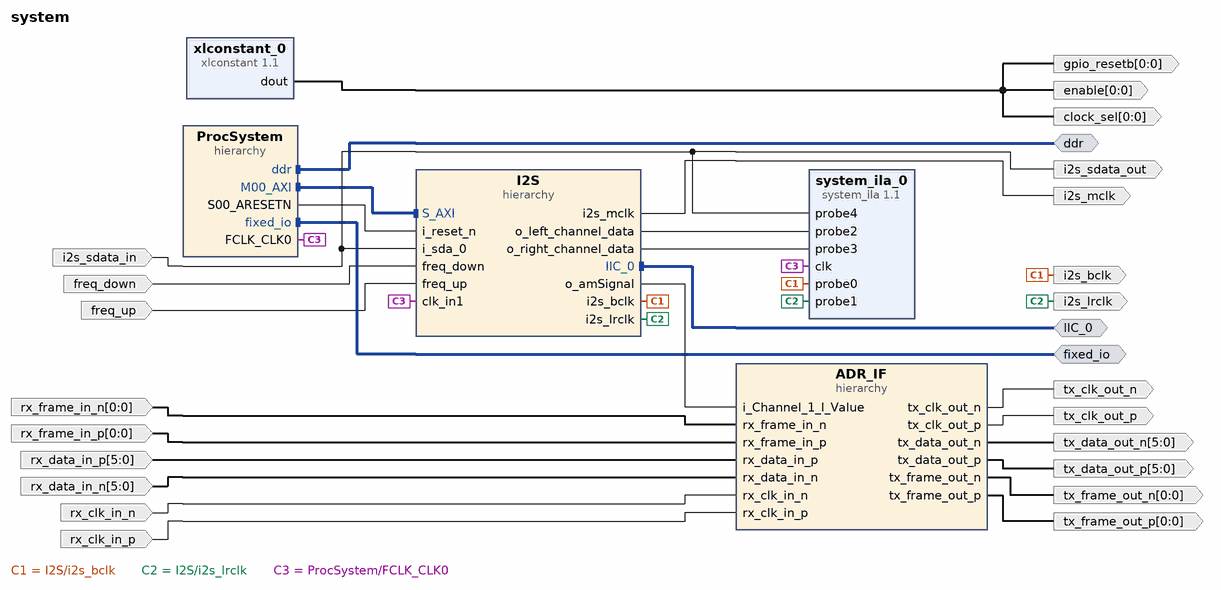
[diagram p0: block diagram of the top level]
# Vivado block design system, xc7z035ifbg676-2L, Vivado 2021.1
create_bd_design system

create_bd_intf_port -mode Master -vlnv xilinx.com:interface:ddrx_rtl:1.0 ddr
create_bd_intf_port -mode Master -vlnv xilinx.com:display_processing_system7:fixedio_rtl:1.0 fixed_io
create_bd_intf_port -mode Master -vlnv xilinx.com:interface:iic_rtl:1.0 IIC_0
create_bd_port -dir O -type clk i2s_bclk
create_bd_port -dir O i2s_lrclk
create_bd_port -dir I freq_up
create_bd_port -dir I freq_down
create_bd_port -dir O -type clk i2s_mclk
set_property -dict {CONFIG.FREQ_HZ 12293853} [get_bd_ports i2s_mclk]
create_bd_port -dir I -type clk rx_clk_in_n
create_bd_port -dir I -type clk rx_clk_in_p
create_bd_port -dir O -type clk tx_clk_out_n
create_bd_port -dir O -type clk tx_clk_out_p
create_bd_port -dir O -from 5 -to 0 tx_data_out_p
create_bd_port -dir O -from 0 -to 0 tx_frame_out_p
create_bd_port -dir O -from 5 -to 0 tx_data_out_n
create_bd_port -dir O -from 0 -to 0 tx_frame_out_n
create_bd_port -dir I -from 0 -to 0 rx_frame_in_n
create_bd_port -dir I -from 0 -to 0 rx_frame_in_p
create_bd_port -dir I -from 5 -to 0 rx_data_in_p
create_bd_port -dir I -from 5 -to 0 rx_data_in_n
create_bd_port -dir O -from 0 -to 0 clock_sel
create_bd_port -dir O -from 0 -to 0 enable
create_bd_port -dir O -from 0 -to 0 gpio_resetb
create_bd_port -dir O i2s_sdata_out
create_bd_port -dir I i2s_sdata_in

create_bd_cell -type hier ProcSystem
create_bd_cell -type hier I2S
create_bd_cell -type hier ADR_IF
create_bd_cell -type ip -vlnv xilinx.com:ip:xlconstant:1.1 xlconstant_0
create_bd_cell -type ip -vlnv xilinx.com:ip:system_ila:1.1 system_ila_0
set_property -dict [list \
  CONFIG.C_DATA_DEPTH 65536 \
  CONFIG.C_MON_TYPE NATIVE \
  CONFIG.C_NUM_OF_PROBES 5 \
  CONFIG.C_PROBE0_TYPE 0 \
] [get_bd_cells system_ila_0]

# ---- hierarchy /ProcSystem ----
current_bd_instance /ProcSystem
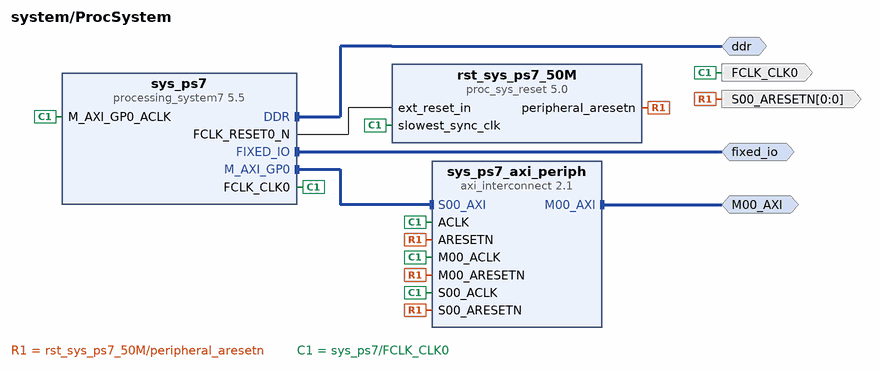
[diagram p1: block diagram inside /ProcSystem]
create_bd_intf_pin -mode Master -vlnv xilinx.com:interface:ddrx_rtl:1.0 ddr
create_bd_intf_pin -mode Master -vlnv xilinx.com:display_processing_system7:fixedio_rtl:1.0 fixed_io
create_bd_intf_pin -mode Master -vlnv xilinx.com:interface:aximm_rtl:1.0 M00_AXI
create_bd_pin -dir O -type clk FCLK_CLK0
create_bd_pin -dir O -from 0 -to 0 -type rst S00_ARESETN

create_bd_cell -type ip -vlnv xilinx.com:ip:processing_system7:5.5 sys_ps7
set_property -dict [list \
  CONFIG.PCW_APU_PERIPHERAL_FREQMHZ 666.666666 \
  CONFIG.PCW_CPU_CPU_6X4X_MAX_RANGE 800 \
  CONFIG.PCW_ENET0_PERIPHERAL_ENABLE 0 \
  CONFIG.PCW_ENET1_PERIPHERAL_CLKSRC External \
  CONFIG.PCW_FPGA0_PERIPHERAL_FREQMHZ 100 \
  CONFIG.PCW_FPGA1_PERIPHERAL_FREQMHZ 200.0 \
  CONFIG.PCW_FPGA2_PERIPHERAL_FREQMHZ 200.0 \
  CONFIG.PCW_GPIO_MIO_GPIO_ENABLE 0 \
  CONFIG.PCW_IRQ_F2P_INTR 1 \
  CONFIG.PCW_IRQ_F2P_MODE REVERSE \
  CONFIG.PCW_PERIPHERAL_BOARD_PRESET None \
  CONFIG.PCW_PRESET_BANK0_VOLTAGE {LVCMOS 1.8V} \
  CONFIG.PCW_PRESET_BANK1_VOLTAGE {LVCMOS 1.8V} \
  CONFIG.PCW_QSPI_PERIPHERAL_ENABLE 0 \
  CONFIG.PCW_SD0_PERIPHERAL_ENABLE 0 \
  CONFIG.PCW_UART1_PERIPHERAL_ENABLE 1 \
  CONFIG.PCW_UART1_UART1_IO {MIO 48 .. 49} \
  CONFIG.PCW_UART_PERIPHERAL_FREQMHZ 100 \
  CONFIG.PCW_UIPARAM_DDR_FREQ_MHZ 533.333333 \
  CONFIG.PCW_UIPARAM_DDR_PARTNO {MT41K256M16 RE-125} \
  CONFIG.PCW_USB0_PERIPHERAL_ENABLE 0 \
  CONFIG.PCW_USE_FABRIC_INTERRUPT 1 \
  CONFIG.preset None \
] [get_bd_cells sys_ps7]
# 339 more settings of sys_ps7 are not shown: defaults, MIO pin electricals, DDR timing, and values the tool derives
create_bd_cell -type ip -vlnv xilinx.com:ip:proc_sys_reset:5.0 rst_sys_ps7_50M
create_bd_cell -type ip -vlnv xilinx.com:ip:axi_interconnect:2.1 sys_ps7_axi_periph
set_property -dict {CONFIG.NUM_MI 1} [get_bd_cells sys_ps7_axi_periph]

# ---- hierarchy /I2S ----
current_bd_instance /I2S
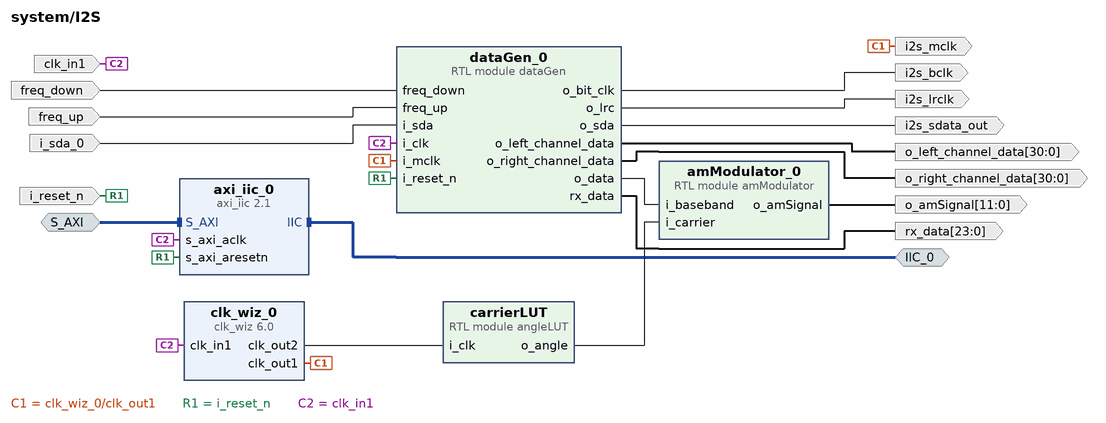
[diagram p2: block diagram inside /I2S]
create_bd_intf_pin -mode Slave -vlnv xilinx.com:interface:aximm_rtl:1.0 S_AXI
create_bd_intf_pin -mode Master -vlnv xilinx.com:interface:iic_rtl:1.0 IIC_0
create_bd_pin -dir I -type clk clk_in1
create_bd_pin -dir I i_reset_n
create_bd_pin -dir O i2s_mclk
create_bd_pin -dir O -type clk i2s_bclk
create_bd_pin -dir O i2s_lrclk
create_bd_pin -dir O i2s_sdata_out
create_bd_pin -dir I freq_up
create_bd_pin -dir I freq_down
create_bd_pin -dir O -from 11 -to 0 o_amSignal
create_bd_pin -dir I i_sda_0
create_bd_pin -dir O -from 23 -to 0 rx_data
create_bd_pin -dir O -from 30 -to 0 o_left_channel_data
create_bd_pin -dir O -from 30 -to 0 o_right_channel_data

create_bd_cell -type module -reference angleLUT carrierLUT
create_bd_cell -type ip -vlnv xilinx.com:ip:axi_iic:2.1 axi_iic_0
create_bd_cell -type ip -vlnv xilinx.com:ip:clk_wiz:6.0 clk_wiz_0
set_property -dict [list \
  CONFIG.CLKOUT1_JITTER 198.012 \
  CONFIG.CLKOUT1_PHASE_ERROR 96.739 \
  CONFIG.CLKOUT1_REQUESTED_OUT_FREQ 12.288 \
  CONFIG.CLKOUT2_JITTER 122.415 \
  CONFIG.CLKOUT2_PHASE_ERROR 96.739 \
  CONFIG.CLKOUT2_REQUESTED_OUT_FREQ 128 \
  CONFIG.CLKOUT2_USED true \
  CONFIG.MMCM_CLKFBOUT_MULT_F 10.250 \
  CONFIG.MMCM_CLKOUT0_DIVIDE_F 83.375 \
  CONFIG.MMCM_CLKOUT1_DIVIDE 8 \
  CONFIG.MMCM_DIVCLK_DIVIDE 1 \
  CONFIG.NUM_OUT_CLKS 2 \
  CONFIG.USE_LOCKED false \
  CONFIG.USE_RESET false \
] [get_bd_cells clk_wiz_0]
create_bd_cell -type module -reference amModulator amModulator_0
create_bd_cell -type module -reference dataGen dataGen_0

# ---- hierarchy /ADR_IF ----
current_bd_instance /ADR_IF
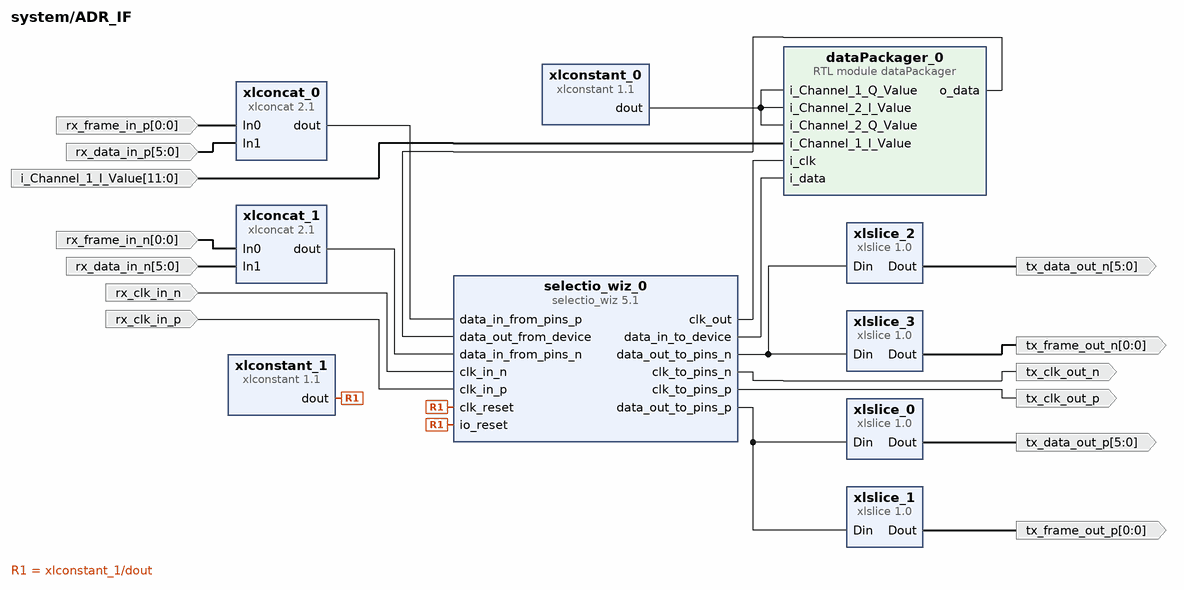
[diagram p3: block diagram inside /ADR_IF]
create_bd_pin -dir O -from 5 -to 0 tx_data_out_p
create_bd_pin -dir I -from 0 -to 0 rx_frame_in_p
create_bd_pin -dir I -from 5 -to 0 rx_data_in_p
create_bd_pin -dir I -from 0 -to 0 rx_frame_in_n
create_bd_pin -dir I -from 5 -to 0 rx_data_in_n
create_bd_pin -dir O -from 0 -to 0 tx_frame_out_p
create_bd_pin -dir O -from 5 -to 0 tx_data_out_n
create_bd_pin -dir I -from 11 -to 0 i_Channel_1_I_Value
create_bd_pin -dir I -type clk rx_clk_in_p
create_bd_pin -dir I -type clk rx_clk_in_n
create_bd_pin -dir O -type clk tx_clk_out_p
create_bd_pin -dir O -type clk tx_clk_out_n
create_bd_pin -dir O -from 0 -to 0 tx_frame_out_n

create_bd_cell -type ip -vlnv xilinx.com:ip:xlslice:1.0 xlslice_0
set_property -dict {CONFIG.DIN_FROM 6 CONFIG.DIN_TO 1 CONFIG.DIN_WIDTH 7 CONFIG.DOUT_WIDTH 6} [get_bd_cells xlslice_0]
create_bd_cell -type ip -vlnv xilinx.com:ip:xlconcat:2.1 xlconcat_0
set_property -dict {CONFIG.IN0_WIDTH 1 CONFIG.IN1_WIDTH 6} [get_bd_cells xlconcat_0]
create_bd_cell -type ip -vlnv xilinx.com:ip:xlconcat:2.1 xlconcat_1
set_property -dict {CONFIG.IN0_WIDTH 1 CONFIG.IN1_WIDTH 6} [get_bd_cells xlconcat_1]
create_bd_cell -type ip -vlnv xilinx.com:ip:xlconstant:1.1 xlconstant_0
set_property -dict {CONFIG.CONST_VAL 0 CONFIG.CONST_WIDTH 12} [get_bd_cells xlconstant_0]
create_bd_cell -type ip -vlnv xilinx.com:ip:xlslice:1.0 xlslice_1
set_property -dict {CONFIG.DIN_FROM 0 CONFIG.DIN_TO 0 CONFIG.DIN_WIDTH 7 CONFIG.DOUT_WIDTH 1} [get_bd_cells xlslice_1]
create_bd_cell -type ip -vlnv xilinx.com:ip:xlslice:1.0 xlslice_2
set_property -dict {CONFIG.DIN_FROM 6 CONFIG.DIN_TO 1 CONFIG.DIN_WIDTH 7 CONFIG.DOUT_WIDTH 6} [get_bd_cells xlslice_2]
create_bd_cell -type ip -vlnv xilinx.com:ip:xlconstant:1.1 xlconstant_1
set_property -dict {CONFIG.CONST_VAL 0} [get_bd_cells xlconstant_1]
create_bd_cell -type module -reference dataPackager dataPackager_0
create_bd_cell -type ip -vlnv xilinx.com:ip:selectio_wiz:5.1 selectio_wiz_0
set_property -dict [list \
  CONFIG.BUS_DIR SEPARATE \
  CONFIG.BUS_IO_STD LVDS \
  CONFIG.BUS_SIG_TYPE DIFF \
  CONFIG.CLK_FWD true \
  CONFIG.CLK_FWD_IO_STD LVDS \
  CONFIG.CLK_FWD_SIG_TYPE DIFF \
  CONFIG.SELIO_ACTIVE_EDGE DDR \
  CONFIG.SELIO_BUS_IN_DELAY NONE \
  CONFIG.SELIO_CLK_IO_STD LVDS \
  CONFIG.SELIO_CLK_SIG_TYPE DIFF \
  CONFIG.SELIO_INTERFACE_TYPE NETWORKING \
  CONFIG.SERIALIZATION_FACTOR 4 \
  CONFIG.SYSTEM_DATA_WIDTH 7 \
] [get_bd_cells selectio_wiz_0]
create_bd_cell -type ip -vlnv xilinx.com:ip:xlslice:1.0 xlslice_3
set_property -dict {CONFIG.DIN_FROM 0 CONFIG.DIN_TO 0 CONFIG.DIN_WIDTH 7 CONFIG.DOUT_WIDTH 1} [get_bd_cells xlslice_3]

# ---- connections ----

current_bd_instance /ProcSystem
connect_bd_intf_net [get_bd_intf_pins ddr] [get_bd_intf_pins sys_ps7/DDR]
connect_bd_intf_net [get_bd_intf_pins fixed_io] [get_bd_intf_pins sys_ps7/FIXED_IO]
connect_bd_intf_net [get_bd_intf_pins sys_ps7/M_AXI_GP0] [get_bd_intf_pins sys_ps7_axi_periph/S00_AXI]
connect_bd_intf_net [get_bd_intf_pins M00_AXI] [get_bd_intf_pins sys_ps7_axi_periph/M00_AXI]
connect_bd_net [get_bd_pins rst_sys_ps7_50M/peripheral_aresetn] \
  [get_bd_pins S00_ARESETN] [get_bd_pins sys_ps7_axi_periph/S00_ARESETN] [get_bd_pins sys_ps7_axi_periph/M00_ARESETN] \
  [get_bd_pins sys_ps7_axi_periph/ARESETN]
connect_bd_net -net sys_cpu_clk [get_bd_pins sys_ps7/FCLK_CLK0] \
  [get_bd_pins FCLK_CLK0] [get_bd_pins rst_sys_ps7_50M/slowest_sync_clk] [get_bd_pins sys_ps7_axi_periph/S00_ACLK] \
  [get_bd_pins sys_ps7_axi_periph/M00_ACLK] [get_bd_pins sys_ps7_axi_periph/ACLK] [get_bd_pins sys_ps7/M_AXI_GP0_ACLK]
connect_bd_net [get_bd_pins sys_ps7/FCLK_RESET0_N] [get_bd_pins rst_sys_ps7_50M/ext_reset_in]

current_bd_instance /I2S
connect_bd_intf_net [get_bd_intf_pins IIC_0] [get_bd_intf_pins axi_iic_0/IIC]
connect_bd_intf_net [get_bd_intf_pins S_AXI] [get_bd_intf_pins axi_iic_0/S_AXI]
connect_bd_net [get_bd_pins amModulator_0/o_amSignal] [get_bd_pins o_amSignal]
connect_bd_net [get_bd_pins carrierLUT/o_angle] [get_bd_pins amModulator_0/i_carrier]
connect_bd_net [get_bd_pins clk_wiz_0/clk_out1] [get_bd_pins i2s_mclk] [get_bd_pins dataGen_0/i_mclk]
connect_bd_net [get_bd_pins clk_wiz_0/clk_out2] [get_bd_pins carrierLUT/i_clk]
connect_bd_net -net dataGen_0_o_bit_clk [get_bd_pins dataGen_0/o_bit_clk] [get_bd_pins i2s_bclk]
connect_bd_net [get_bd_pins dataGen_0/o_data] [get_bd_pins amModulator_0/i_baseband]
connect_bd_net [get_bd_pins dataGen_0/o_left_channel_data] [get_bd_pins o_left_channel_data]
connect_bd_net [get_bd_pins dataGen_0/o_lrc] [get_bd_pins i2s_lrclk]
connect_bd_net [get_bd_pins dataGen_0/o_right_channel_data] [get_bd_pins o_right_channel_data]
connect_bd_net [get_bd_pins dataGen_0/o_sda] [get_bd_pins i2s_sdata_out]
connect_bd_net [get_bd_pins dataGen_0/rx_data] [get_bd_pins rx_data]
connect_bd_net -net freq_down_0_1 [get_bd_pins freq_down] [get_bd_pins dataGen_0/freq_down]
connect_bd_net -net freq_up_0_1 [get_bd_pins freq_up] [get_bd_pins dataGen_0/freq_up]
connect_bd_net -net i_sda_0_1 [get_bd_pins i_sda_0] [get_bd_pins dataGen_0/i_sda]
connect_bd_net -net rst_sys_ps7_50M_peripheral_aresetn [get_bd_pins i_reset_n] [get_bd_pins axi_iic_0/s_axi_aresetn] [get_bd_pins dataGen_0/i_reset_n]
connect_bd_net -net sys_cpu_clk [get_bd_pins clk_in1] [get_bd_pins clk_wiz_0/clk_in1] [get_bd_pins axi_iic_0/s_axi_aclk] [get_bd_pins dataGen_0/i_clk]
set_property HDL_ATTRIBUTE.DEBUG true [get_bd_nets dataGen_0_o_bit_clk]

current_bd_instance /ADR_IF
connect_bd_net -net In0_0_1 [get_bd_pins rx_frame_in_n] [get_bd_pins xlconcat_1/In0]
connect_bd_net -net In0_1_1 [get_bd_pins rx_frame_in_p] [get_bd_pins xlconcat_0/In0]
connect_bd_net -net In1_0_1 [get_bd_pins rx_data_in_p] [get_bd_pins xlconcat_0/In1]
connect_bd_net -net In1_1_1 [get_bd_pins rx_data_in_n] [get_bd_pins xlconcat_1/In1]
connect_bd_net -net amModulator_0_o_amSignal [get_bd_pins i_Channel_1_I_Value] [get_bd_pins dataPackager_0/i_Channel_1_I_Value]
connect_bd_net -net clk_in_n_0_1 [get_bd_pins rx_clk_in_n] [get_bd_pins selectio_wiz_0/clk_in_n]
connect_bd_net -net clk_in_p_0_1 [get_bd_pins rx_clk_in_p] [get_bd_pins selectio_wiz_0/clk_in_p]
connect_bd_net [get_bd_pins dataPackager_0/o_data] [get_bd_pins selectio_wiz_0/data_out_from_device]
connect_bd_net [get_bd_pins selectio_wiz_0/clk_out] [get_bd_pins dataPackager_0/i_clk]
connect_bd_net [get_bd_pins selectio_wiz_0/clk_to_pins_n] [get_bd_pins tx_clk_out_n]
connect_bd_net [get_bd_pins selectio_wiz_0/clk_to_pins_p] [get_bd_pins tx_clk_out_p]
connect_bd_net [get_bd_pins selectio_wiz_0/data_in_to_device] [get_bd_pins dataPackager_0/i_data]
connect_bd_net [get_bd_pins selectio_wiz_0/data_out_to_pins_n] [get_bd_pins xlslice_2/Din] [get_bd_pins xlslice_3/Din]
connect_bd_net [get_bd_pins selectio_wiz_0/data_out_to_pins_p] [get_bd_pins xlslice_0/Din] [get_bd_pins xlslice_1/Din]
connect_bd_net [get_bd_pins xlconcat_0/dout] [get_bd_pins selectio_wiz_0/data_in_from_pins_p]
connect_bd_net [get_bd_pins xlconcat_1/dout] [get_bd_pins selectio_wiz_0/data_in_from_pins_n]
connect_bd_net [get_bd_pins xlconstant_0/dout] \
  [get_bd_pins dataPackager_0/i_Channel_1_Q_Value] [get_bd_pins dataPackager_0/i_Channel_2_I_Value] \
  [get_bd_pins dataPackager_0/i_Channel_2_Q_Value]
connect_bd_net [get_bd_pins xlconstant_1/dout] [get_bd_pins selectio_wiz_0/clk_reset] [get_bd_pins selectio_wiz_0/io_reset]
connect_bd_net [get_bd_pins xlslice_0/Dout] [get_bd_pins tx_data_out_p]
connect_bd_net [get_bd_pins xlslice_1/Dout] [get_bd_pins tx_frame_out_p]
connect_bd_net [get_bd_pins xlslice_2/Dout] [get_bd_pins tx_data_out_n]
connect_bd_net [get_bd_pins xlslice_3/Dout] [get_bd_pins tx_frame_out_n]

current_bd_instance /
connect_bd_intf_net -intf_net axi_iic_0_IIC [get_bd_intf_ports IIC_0] [get_bd_intf_pins I2S/IIC_0]
connect_bd_intf_net -intf_net sys_ps7_DDR [get_bd_intf_ports ddr] [get_bd_intf_pins ProcSystem/ddr]
connect_bd_intf_net -intf_net sys_ps7_FIXED_IO [get_bd_intf_ports fixed_io] [get_bd_intf_pins ProcSystem/fixed_io]
connect_bd_intf_net [get_bd_intf_pins ProcSystem/M00_AXI] [get_bd_intf_pins I2S/S_AXI]
connect_bd_net [get_bd_pins I2S/o_left_channel_data] [get_bd_pins system_ila_0/probe2]
connect_bd_net [get_bd_pins I2S/o_right_channel_data] [get_bd_pins system_ila_0/probe3]
connect_bd_net -net In0_0_1 [get_bd_ports rx_frame_in_n] [get_bd_pins ADR_IF/rx_frame_in_n]
connect_bd_net -net In0_1_1 [get_bd_ports rx_frame_in_p] [get_bd_pins ADR_IF/rx_frame_in_p]
connect_bd_net -net In1_0_1 [get_bd_ports rx_data_in_p] [get_bd_pins ADR_IF/rx_data_in_p]
connect_bd_net -net In1_1_1 [get_bd_ports rx_data_in_n] [get_bd_pins ADR_IF/rx_data_in_n]
connect_bd_net -net amModulator_0_o_amSignal [get_bd_pins I2S/o_amSignal] [get_bd_pins ADR_IF/i_Channel_1_I_Value]
connect_bd_net -net clk_in_n_0_1 [get_bd_ports rx_clk_in_n] [get_bd_pins ADR_IF/rx_clk_in_n]
connect_bd_net -net clk_in_p_0_1 [get_bd_ports rx_clk_in_p] [get_bd_pins ADR_IF/rx_clk_in_p]
connect_bd_net -net clk_wiz_0_clk_out1 [get_bd_pins I2S/i2s_mclk] [get_bd_ports i2s_mclk]
connect_bd_net -net dataGen_0_o_bit_clk [get_bd_pins I2S/i2s_bclk] [get_bd_ports i2s_bclk] [get_bd_pins system_ila_0/probe0]
connect_bd_net -net dataGen_0_o_lrc [get_bd_pins I2S/i2s_lrclk] [get_bd_ports i2s_lrclk] [get_bd_pins system_ila_0/probe1]
connect_bd_net -net freq_down_0_1 [get_bd_ports freq_down] [get_bd_pins I2S/freq_down]
connect_bd_net -net freq_up_0_1 [get_bd_ports freq_up] [get_bd_pins I2S/freq_up]
connect_bd_net -net i_sda_0_0_1 [get_bd_ports i2s_sdata_in] [get_bd_pins I2S/i_sda_0] [get_bd_ports i2s_sdata_out] [get_bd_pins system_ila_0/probe4]
connect_bd_net -net rst_sys_ps7_50M_peripheral_aresetn [get_bd_pins ProcSystem/S00_ARESETN] [get_bd_pins I2S/i_reset_n]
connect_bd_net -net selectio_wiz_0_clk_to_pins_n [get_bd_pins ADR_IF/tx_clk_out_n] [get_bd_ports tx_clk_out_n]
connect_bd_net -net selectio_wiz_0_clk_to_pins_p [get_bd_pins ADR_IF/tx_clk_out_p] [get_bd_ports tx_clk_out_p]
connect_bd_net -net sys_cpu_clk [get_bd_pins ProcSystem/FCLK_CLK0] [get_bd_pins I2S/clk_in1] [get_bd_pins system_ila_0/clk]
connect_bd_net [get_bd_pins xlconstant_0/dout] [get_bd_ports clock_sel] [get_bd_ports enable] [get_bd_ports gpio_resetb]
connect_bd_net -net xlslice_0_Dout [get_bd_pins ADR_IF/tx_data_out_p] [get_bd_ports tx_data_out_p]
connect_bd_net -net xlslice_1_Dout [get_bd_pins ADR_IF/tx_frame_out_p] [get_bd_ports tx_frame_out_p]
connect_bd_net -net xlslice_2_Dout [get_bd_pins ADR_IF/tx_data_out_n] [get_bd_ports tx_data_out_n]
connect_bd_net -net xlslice_3_Dout [get_bd_pins ADR_IF/tx_frame_out_n] [get_bd_ports tx_frame_out_n]
set_property HDL_ATTRIBUTE.DEBUG true [get_bd_nets dataGen_0_o_bit_clk]
set_property HDL_ATTRIBUTE.MARK_DEBUG true [get_bd_nets dataGen_0_o_bit_clk]

# ---- address map ----
assign_bd_address -offset 0x41600000 -range 64K -target_address_space [get_bd_addr_spaces ProcSystem/sys_ps7/Data] [get_bd_addr_segs I2S/axi_iic_0/S_AXI/Reg]

validate_bd_design
save_bd_design
